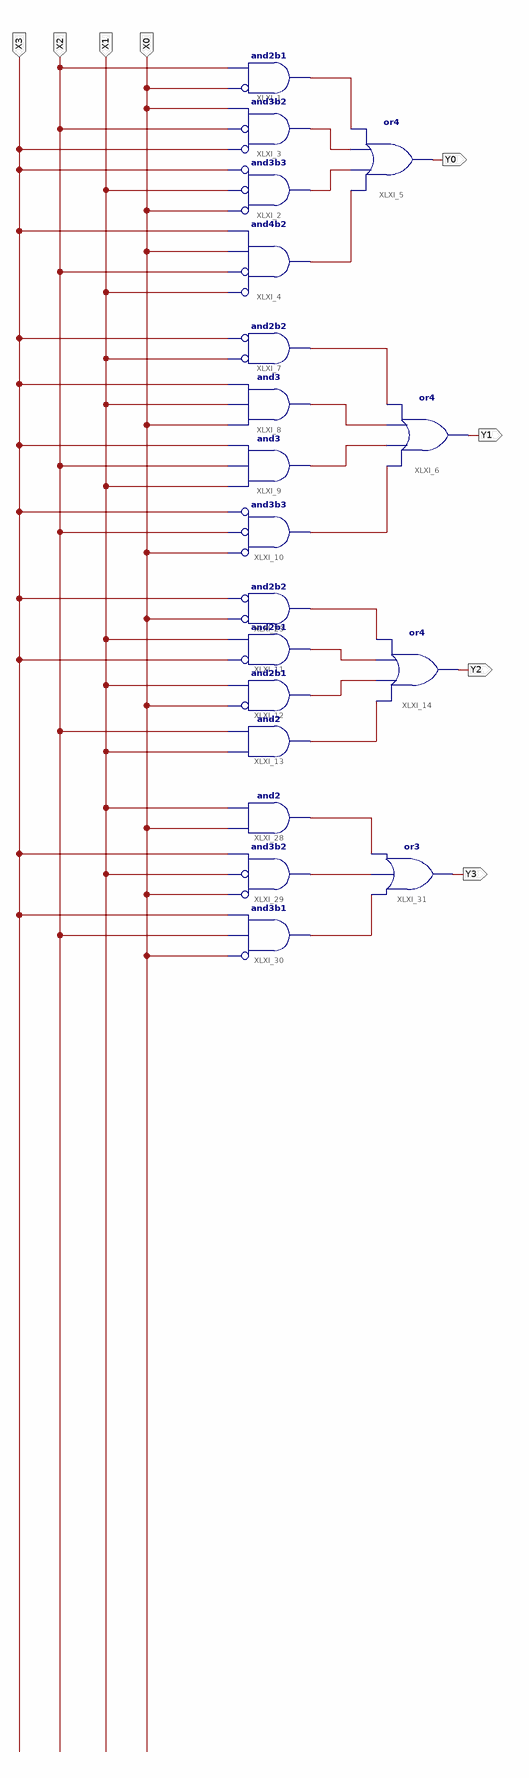
[diagram p0: schematic sheet 1]
// Xilinx ISE schematic DNF.sch (artix7) as structural Verilog: 19 symbols, 8 ports
module DNF (
  input  X3,
  input  X2,
  input  X1,
  input  X0,
  output Y0,
  output Y1,
  output Y2,
  output Y3
);

  wire XLXN_5, XLXN_6, XLXN_8, XLXN_9, XLXN_12, XLXN_13, XLXN_14, XLXN_15, XLXN_16, XLXN_17, XLXN_18,
       XLXN_19, XLXN_20, XLXN_22, XLXN_23;

  and XLXI_1 (XLXN_5, ~X0, X2);  // and2b1
  and XLXI_2 (XLXN_8, ~X0, ~X1, ~X3);  // and3b3
  and XLXI_3 (XLXN_6, ~X3, ~X2, X0);  // and3b2
  and XLXI_4 (XLXN_9, ~X1, ~X2, X0, X3);  // and4b2
  or XLXI_5 (Y0, XLXN_9, XLXN_8, XLXN_6, XLXN_5);
  or XLXI_6 (Y1, XLXN_12, XLXN_13, XLXN_14, XLXN_15);
  and XLXI_7 (XLXN_15, ~X1, ~X3);  // and2b2
  and XLXI_8 (XLXN_14, X0, X1, X3);
  and XLXI_9 (XLXN_13, X1, X2, X3);
  and XLXI_10 (XLXN_12, ~X0, ~X2, ~X3);  // and3b3
  or XLXI_14 (Y2, XLXN_16, XLXN_17, XLXN_18, XLXN_19);
  and XLXI_23 (XLXN_19, ~X0, ~X3);  // and2b2
  and XLXI_11 (XLXN_18, ~X3, X1);  // and2b1
  and XLXI_12 (XLXN_17, ~X0, X1);  // and2b1
  and XLXI_13 (XLXN_16, X1, X2);
  and XLXI_28 (XLXN_20, X0, X1);
  and XLXI_29 (XLXN_22, ~X0, ~X1, X3);  // and3b2
  and XLXI_30 (XLXN_23, ~X0, X2, X3);  // and3b1
  or XLXI_31 (Y3, XLXN_23, XLXN_22, XLXN_20);
endmodule
